# Altium schematic sheet Top.SchDoc
size A4; Organization: Medical Technologies CZ a.s.; SheetNumber: 1; SheetTotal: 10; Version1: N/A; Version2: N/A; Version3: N/A; Change1description: N/A; Change2description: N/A; Change3description: N/A; Change1DrawnBy: N/A; Change2DrawnBy: N/A; Change3DrawnBy: N/A; Change1CheckedBy: N/A; Change2CheckedBy: N/A; Change3CheckedBy: N/A; PreviusVersion_Chng1: N/A; PreviusVersion_Chng2: N/A; PreviusVersion_Chng3: N/A; Variant1description: Standard assembly; Variant2description: N/A; Variant3description: N/A; Variant4description: N/A; PrimaryCard1: XXXxxxXXX; PrimaryCard2: N/A; PrimaryCard3: N/A; PrimaryCard4: N/A; DocumentName: Docname
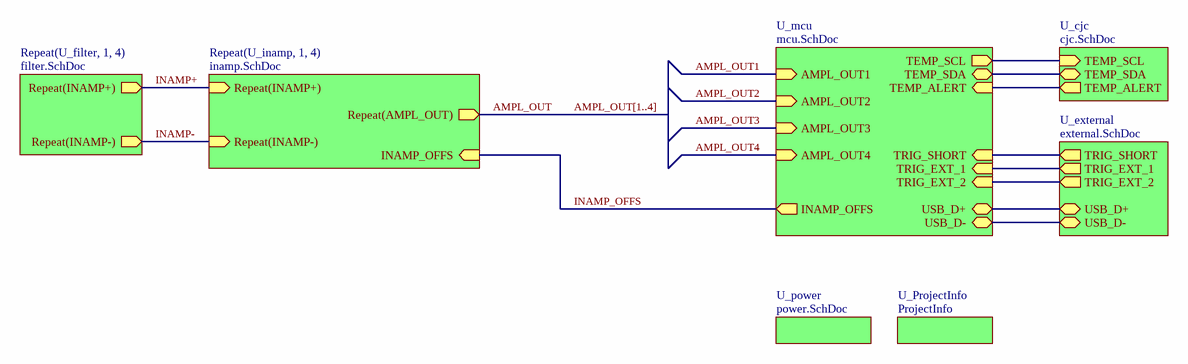
[diagram p0: Top.SchDoc]

## Sub-sheets
Repeat(U_filter, 1, 4) = filter.SchDoc: Repeat(INAMP+) (out), Repeat(INAMP-) (out)
Repeat(U_inamp, 1, 4) = inamp.SchDoc: Repeat(INAMP-) (in), Repeat(INAMP+) (in), Repeat(AMPL_OUT) (out), INAMP_OFFS (in)
U_cjc = cjc.SchDoc: TEMP_SCL (in), TEMP_SDA (bidir), TEMP_ALERT (out)
U_external = external.SchDoc: USB_D+ (bidir), USB_D- (bidir), TRIG_SHORT (out), TRIG_EXT_1 (out), TRIG_EXT_2 (out)
U_mcu = mcu.SchDoc: AMPL_OUT1 (in), AMPL_OUT2 (in), AMPL_OUT3 (in), AMPL_OUT4 (in), TEMP_ALERT (in), TEMP_SCL (out), TEMP_SDA (bidir), USB_D+ (bidir), USB_D- (bidir), TRIG_SHORT (in), TRIG_EXT_1 (in), TRIG_EXT_2 (in), INAMP_OFFS (out)
U_power = power.SchDoc: no entries
U_ProjectInfo = ProjectInfo: no entries

## Nets
AMPL_OUT: sheet Repeat(U_inamp, 1, 4)/Repeat(AMPL_OUT)
AMPL_OUT1: sheet U_mcu/AMPL_OUT1
AMPL_OUT2: sheet U_mcu/AMPL_OUT2
AMPL_OUT3: sheet U_mcu/AMPL_OUT3
AMPL_OUT4: sheet U_mcu/AMPL_OUT4
INAMP+: sheet Repeat(U_filter, 1, 4)/Repeat(INAMP+), sheet Repeat(U_inamp, 1, 4)/Repeat(INAMP+)
INAMP-: sheet Repeat(U_filter, 1, 4)/Repeat(INAMP-), sheet Repeat(U_inamp, 1, 4)/Repeat(INAMP-)
INAMP_OFFS: sheet Repeat(U_inamp, 1, 4)/INAMP_OFFS, sheet U_mcu/INAMP_OFFS
(unnamed): sheet U_cjc/TEMP_SCL, sheet U_mcu/TEMP_SCL
(unnamed): sheet U_cjc/TEMP_SDA, sheet U_mcu/TEMP_SDA
(unnamed): sheet U_cjc/TEMP_ALERT, sheet U_mcu/TEMP_ALERT
(unnamed): sheet U_mcu/USB_D+, sheet U_external/USB_D+
(unnamed): sheet U_mcu/USB_D-, sheet U_external/USB_D-
(unnamed): sheet U_mcu/TRIG_SHORT, sheet U_external/TRIG_SHORT
(unnamed): sheet U_mcu/TRIG_EXT_1, sheet U_external/TRIG_EXT_1
(unnamed): sheet U_mcu/TRIG_EXT_2, sheet U_external/TRIG_EXT_2

## Buses and harness runs
bus AMPL_OUT[1..4]

## Notes on the sheet
- Číslo výkresu /drawing number/:
- Nazev listu/sheet name/:
- DPS projekt/PCB project/:
- Kreslil /drawn by/ :
- Kontroloval /checked by/:
- Datum /date/:
- List /sheet/:
- /